# EAGLE design untitled (EAGLE 9.6.2)
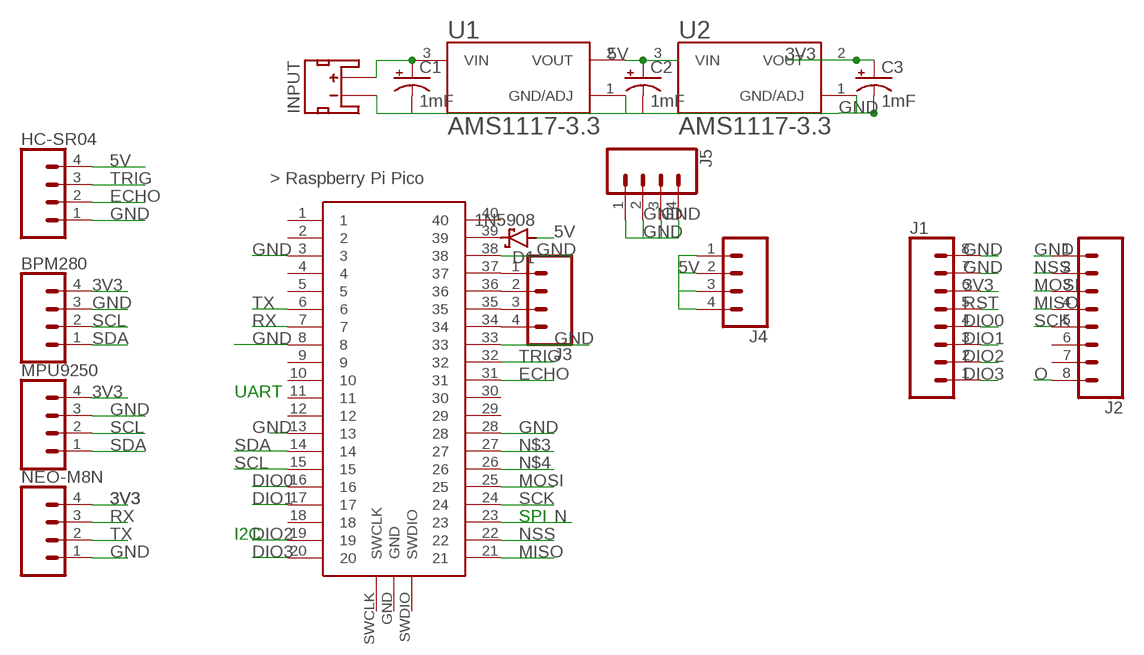
[diagram p0: schematic, sheet 1]

## Parts
BPM280  CONN_04PTH  [1X04]
C1  1mF  1000UF-RADIAL-5MM-25V-20%  [CPOL-RADIAL-5MM-10MM]
C2  1mF  1000UF-RADIAL-5MM-25V-20%  [CPOL-RADIAL-5MM-10MM]
C3  1mF  1000UF-RADIAL-5MM-25V-20%  [CPOL-RADIAL-5MM-10MM]
D1  1N5908  [C4111-15]
HC-SR04  CONN_04PTH  [1X04]
INPUT  JST_2MM_MALE  [JST-2-SMD]
J1  CONN_08NO_SILK_DNP  [1X08_NO_SILK]
J2  CONN_08NO_SILK_DNP  [1X08_NO_SILK]
J3  CONN_041X04_NO_SILK  [1X04_NO_SILK]
J4  CONN_041X04_NO_SILK  [1X04_NO_SILK]
J5  CONN_041X04_NO_SILK  [1X04_NO_SILK]
MPU9250  CONN_04PTH  [1X04]
NEO-M8N  CONN_04PTH  [1X04]
U1  AMS1117-3.3  [SOT229P700X180-4N]
U2  AMS1117-3.3  [SOT229P700X180-4N]
U$1  RASPBERRY-PI-PICO_TH  [FT_RASPBERRY-PI-PICO_TH]

## Nets
3V3: BPM280.4 C3.+ J1.6 MPU9250.4 NEO-M8N.4 U2.2(VOUT)
5V: C2.+ D1.A HC-SR04.4 J4.1 J4.2 J4.3 J4.4 U1.2(VOUT) U2.3(VIN)
DIO0: J1.4 U$1.16
DIO1: J1.3 U$1.17
DIO2: J1.2 U$1.19
DIO3: J1.1 U$1.20
ECHO: HC-SR04.2 U$1.31
GND: BPM280.3 C1.- C2.- C3.- HC-SR04.1 INPUT.1(-) J1.7 J1.8 J2.1 J5.1 J5.2 J5.3 J5.4 MPU9250.3 NEO-M8N.1 U1.1(GND/ADJ) U2.1(GND/ADJ) U$1.3 U$1.8 U$1.13 U$1.28 U$1.33 U$1.38
MISO: J2.4 U$1.21
MOSI: J2.3 U$1.25
N: U$1.23
N$1: C1.+ INPUT.2(+) U1.3(VIN)
N$2: D1.C U$1.39
N$3: U$1.27
N$4: U$1.26
N$5: J3.1 U$1.37
N$6: J3.2 U$1.36
N$7: J3.3 U$1.35
N$8: J3.4 U$1.34
NSS: J2.2 U$1.22
O: J2.8
RST: J1.5
RX: NEO-M8N.3 U$1.7
SCK: J2.5 U$1.24
SCL: BPM280.2 MPU9250.2 U$1.15
SDA: BPM280.1 MPU9250.1 U$1.14
TRIG: HC-SR04.3 U$1.32
TX: NEO-M8N.2 U$1.6
Unconnected: INPUT.NC1(PAD1) INPUT.NC2(PAD2) J2.6 J2.7 U$1.1 U$1.2 U$1.4 U$1.5 U$1.9 U$1.10 U$1.11 U$1.12 U$1.18 U$1.29 U$1.30 U$1.40 U$1.GND U$1.SWCLK U$1.SWDIO

## Notes on the sheet
- UART
- SPI
- I2C

## Library data of the parts
BPM280 HC-SR04 J3-J5 MPU9250 NEO-M8N = SparkFun-Connectors:CONN_04: Multi connection point. Often used as Generic Header-pin footprint for 0.1 inch spaced/style header connections On any of the 0.1 inch spaced packages, you can populate with these: Break Away Headers - Straight <https://www.sparkfun.com/products/116> (PRT-00116) Break Away Male Headers - Right Angle <https://www.sparkfun.com/products/553> (PRT-00553) Female Headers <https://www.sparkfun.com/products/115> (PRT-00115) Break Away Headers - Machine Pin <https://www.sparkfun.com/products/117> (PRT-00117) Break Away Female Headers - Swiss Machine Pin <https://www.sparkfun.com/products/743> (PRT-00743) For SCREWTERMINALS and SPRING TERMINALS visit here: Screw Terimnals on SparkFun.com <https://www.sparkfun.com/search/results?term=Screw+Terminals> (5mm/3.5mm/2.54mm spacing) This device is also useful as a general connection point to wire up your design to another part of your project. Our various solder wires solder well into these plated through hole pads. Hook-Up Wire - Assortment (Stranded, 22 AWG) <https://www.sparkfun.com/products/11375> (PRT-11375) Hook-Up Wire - Assortment (Solid Core, 22 AWG) <https://www.sparkfun.com/products/11367> (PRT-11367) View the entire wire category on our website here <https://www.sparkfun.com/categories/141> Special notes: Molex polarized connector foot print use with SKU : PRT-08231 with associated crimp pins and housings. 1MM SMD Version SKU: PRT-10208; PROD_ID: CONN-09696
C1-C3 = SparkFun-Capacitors:1000UF: 1,000µF/1mF ceramic capacitors A capacitor is a passive two-terminal electrical component used to store electrical energy temporarily in an electric field. CAP-08070; PROD_ID: CAP-09538
D1 = diode:1N5908: DIODE schottky
INPUT = SparkFun-Connectors:JST_2MM_MALE: JST 2MM MALE RA CONNECTOR Two pin, compact surface mount connector. Commonly used as a battery input connection point. We really like the solid locking feeling and high current rating on these small connectors. We use these all the time as battery connectors. Mates to single-cell LiPo batteries. Here is the connector we sell at SparkFun: JST Right Angle Connector - White <https://www.sparkfun.com/products/8612> (PRT-08612) Datasheet <http://www.sparkfun.com/datasheets/Prototyping/Connectors/JST-Horizontal.pdf> It was used on these SparkFun products: SparkFun MOSFET Power Controller <https://www.sparkfun.com/products/11214> (PRT-11214) SparkFun Battery Babysitter - LiPo Battery Manager <https://www.sparkfun.com/products/13777> (PRT-13777) And many, many others that required a lipo battery connection.; PROD_ID: CONN-11443; SF_ID: PRT-08612
J1 J2 = SparkFun-Connectors:CONN_08: Multi connection point. Often used as Generic Header-pin footprint for 0.1 inch spaced/style header connections On any of the 0.1 inch spaced packages, you can populate with these: Break Away Headers - Straight <https://www.sparkfun.com/products/116> (PRT-00116) Break Away Male Headers - Right Angle <https://www.sparkfun.com/products/553> (PRT-00553) Female Headers <https://www.sparkfun.com/products/115> (PRT-00115) Break Away Headers - Machine Pin <https://www.sparkfun.com/products/117> (PRT-00117) Break Away Female Headers - Swiss Machine Pin <https://www.sparkfun.com/products/743> (PRT-00743) Arduino Stackable Header - 8 Pin <https://www.sparkfun.com/products/9279> (PRT-09279) For SCREWTERMINALS and SPRING TERMINALS visit here: Screw Terimnals on SparkFun.com <https://www.sparkfun.com/search/results?term=Screw+Terminals> (5mm/3.5mm/2.54mm spacing) This device is also useful as a general connection point to wire up your design to another part of your project. Our various solder wires solder well into these plated through hole pads. Hook-Up Wire - Assortment (Stranded, 22 AWG) <https://www.sparkfun.com/products/11375> (PRT-11375) Hook-Up Wire - Assortment (Solid Core, 22 AWG) <https://www.sparkfun.com/products/11367> (PRT-11367) View the entire wire category on our website here <https://www.sparkfun.com/categories/141> Special notes: Molex polarized connector foot print use with SKU : PRT-08231 with associated crimp pins and housings. 1MM SMD Version SKU: PRT-10208 NOTES ON THE VARIANTS LOCK and LOCK_LONGPADS... This footprint was designed to help hold the alignment of a through-hole component (i.e. 6-pin header) while soldering it into place. You may notice that each hole has been shifted either up or down by 0.005 of an inch from it's more standard position (which is a perfectly straight line). This slight alteration caused the pins (the squares in the middle) to touch the edges of the holes. Because they are alternating, it causes a "brace" to hold the component in place. 0.005 has proven to be the perfect amount of "off-center" position when using our standard breakaway headers. Although looks a little odd when you look at the bare footprint, once you have a header in there, the alteration is very hard to notice. Also,if you push a header all the way into place, it is covered up entirely on the bottom side.
U1 U2 = AMS1117-3.3:AMS1117-3.3: Check availability <https://pricing.snapeda.com/parts/AMS1117-3.3/Advanced%20Monolithic%20Systems/view-part?ref=eda>; AVAILABILITY: Not in stock; CHECK_PRICES: https://www.snapeda.com/parts/AMS1117-3.3/Advanced+Monolithic+Systems/view-part/?ref=eda; DESCRIPTION: Sot223/Pkg 1-Amp 3.3-Volt Low Drop Out Voltage Regulatator; MF: Advanced Monolithic Systems; MP: AMS1117-3.3; PACKAGE: SOT-223 Seeed Technology; PRICE: None; SNAPEDA_LINK: https://www.snapeda.com/parts/AMS1117-3.3/Advanced+Monolithic+Systems/view-part/?ref=snap
U$1 = pipico:RASPBERRY-PI-PICO_TH: Raspberry Pi Pico microcontroller board for through-hole mounting.

## Board
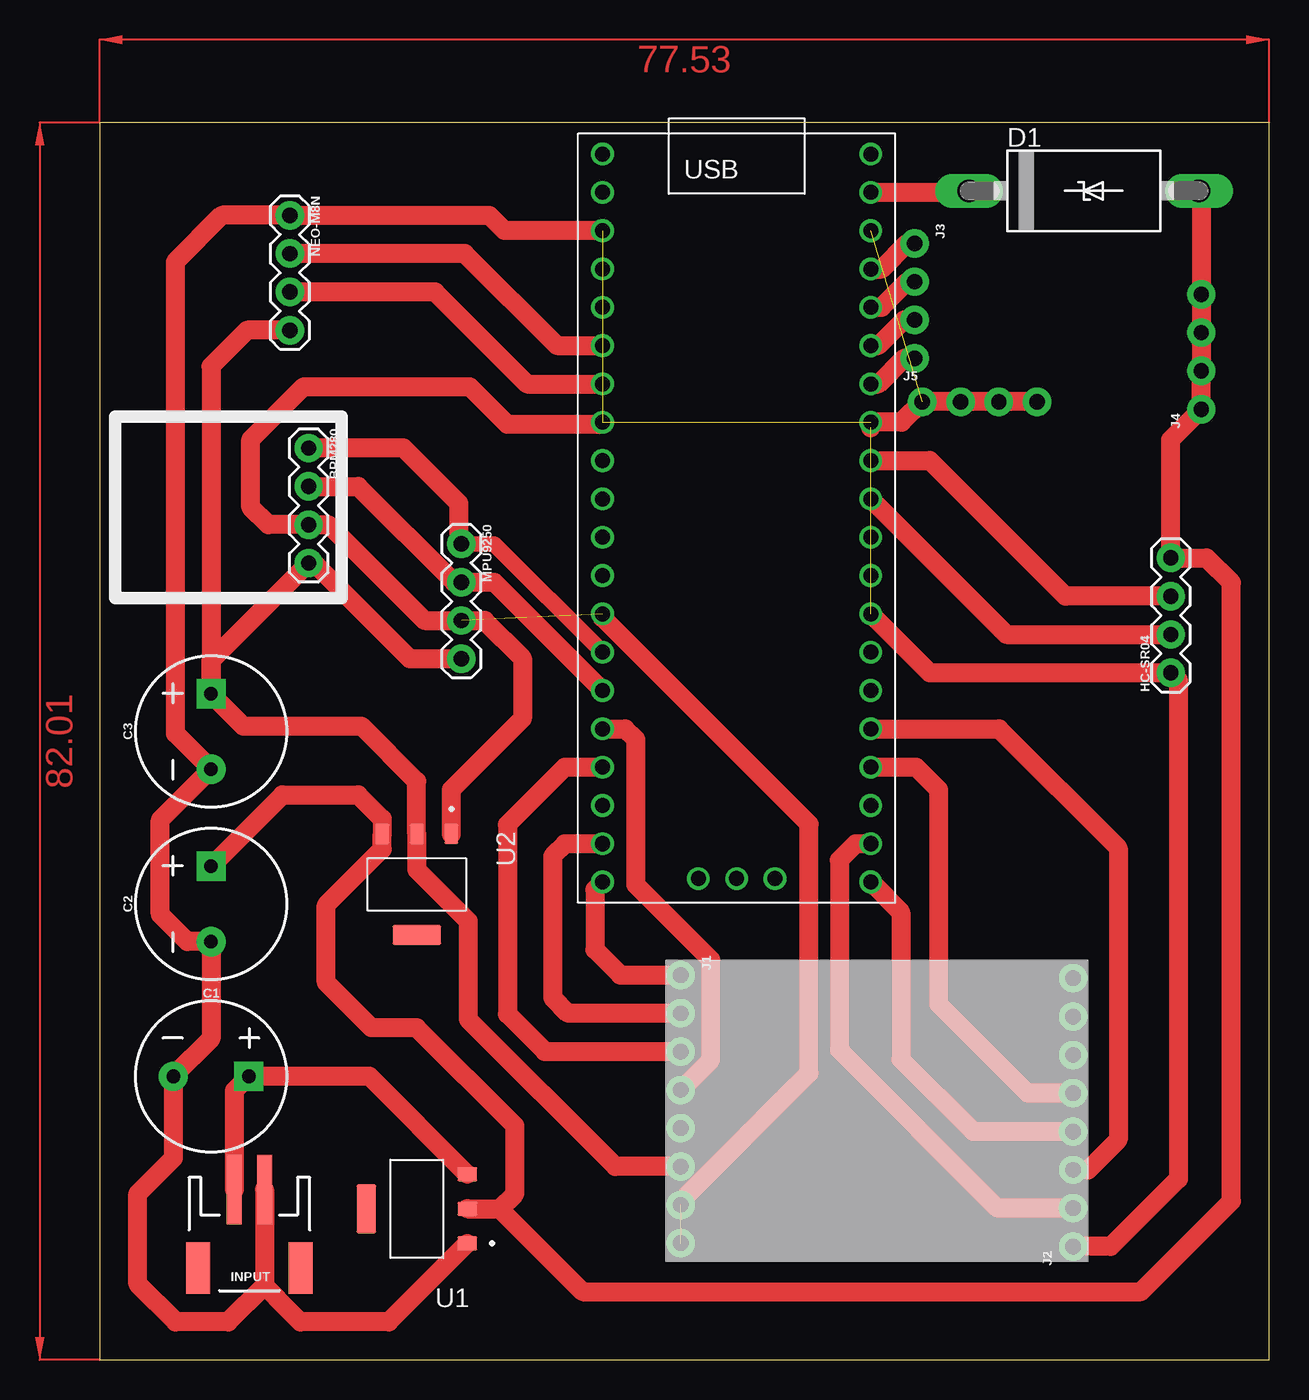
[diagram p1: board, top side]

Size 77.53 x 82.01 mm. Coordinates in mm from the lower left corner, seen from the top.
Outline: 0,0 77.53,0 77.53,82.01 0,82.01 0,0
Copper layers (1*16): Top 0.035mm / dielectric 1.5mm / Bottom 0.035mm
Design rules "default": minimum track width 6mil, minimum drill 0.35mm, track to track 6mil, track to pad 6mil, pad to pad 6mil, via to via 6mil, smd to smd 6mil, copper to edge 40mil, drill to drill 6mil, minimum pad ring 10mil, minimum via ring 8mil, stop-mask expansion 4mil, vias tented up to drill 0mil, thermal gap 10mil

### Footprints (pad centres in the part's own frame; a part is rotated, then mirrored left to right if it is on the bottom)
1X04 = drill 1.016 pad 1.88: 1 0,0; 2 2.54,0; 3 5.08,0; 4 7.62,0
CPOL-RADIAL-5MM-10MM = drill 0.9 pad 1.93 square: + 2.5,0 | drill 0.9 pad 1.93: - -2.5,0
C4111-15 = drill 1.499 long: A 7.62,0; C -7.62,0
JST-2-SMD = smd 1 x 4.6: 1 -1,-3.7; 2 1,-3.7 | smd 1.6 x 3.4: NC1 -3.4,1.5; NC2 3.4,1.5
1X08_NO_SILK = drill 1.016 pad 1.88: 1 0,0; 2 2.54,0; 3 5.08,0; 4 7.62,0; 5 10.16,0; 6 12.7,0; 7 15.24,0; 8 17.78,0
1X04_NO_SILK = drill 1.016 pad 1.88: 1 0,0; 2 2.54,0; 3 5.08,0; 4 7.62,0
SOT229P700X180-4N = smd 1.31 x 0.93: 1 -3.345,2.29; 2 -3.345,0; 3 -3.345,-2.29 | smd 1.31 x 3.24: 4 3.345,0
FT_RASPBERRY-PI-PICO_TH = drill 1: 1 -8.55,24.03; 2 -8.55,21.49; 3 -8.55,18.95; 4 -8.55,16.41; 5 -8.55,13.87; 6 -8.55,11.33; 7 -8.55,8.79; 8 -8.55,6.25; 9 -8.55,3.71; 10 -8.55,1.17; 11 -8.55,-1.37; 12 -8.55,-3.91; 13 -8.55,-6.45; 14 -8.55,-8.99; 15 -8.55,-11.53; 16 -8.55,-14.07; 17 -8.55,-16.61; 18 -8.55,-19.15; 19 -8.55,-21.69; 20 -8.55,-24.23; 21 9.23,-24.23; 22 9.23,-21.69; 23 9.23,-19.15; 24 9.23,-16.61; 25 9.23,-14.07; 26 9.23,-11.53; 27 9.23,-8.99; 28 9.23,-6.45; 29 9.23,-3.91; 30 9.23,-1.37; 31 9.23,1.17; 32 9.23,3.71; 33 9.23,6.25; 34 9.23,8.79; 35 9.23,11.33; 36 9.23,13.87; 37 9.23,16.41; 38 9.23,18.95; 39 9.23,21.49; 40 9.23,24.03; GND 0.34,-24; SWCLK -2.2,-24; SWDIO 2.88,-24

### Placement (x,y rotation side)
BPM280  13.86,60.44 270 top
C1  7.39,18.79 0 top
C2  7.39,30.22 90 top
C3  7.39,41.65 90 top
D1  65.25,77.49 0 top
HC-SR04  71.01,45.54 90 top
INPUT  9.93,7.59 180 top
J1  38.53,25.51 270 top
J2  64.53,7.51 90 top
J3  54.03,74.01 270 top
J4  73.03,63.01 90 top
J5  54.53,63.51 0 top
MPU9250  23.99,54.09 270 top
NEO-M8N  12.61,75.87 270 top
U1  21.03,10.01 180 top
U2  21.03,31.51 270 top
U$1  41.89,55.9 0 top

### Tracks (layer width: path | path; a pad name or v marks a point on that pad's centre or on a via)
3V3
  Top 1.016: J1.6 37.7,12.81 | MPU9250.4 23.84,46.47
  Top 1.27: C3.+ 9.53,42.01 17.36,42.01 21.03,38.34 U2.2 21.03,32.5 24.44,29.09 24.44,22.57 34.2,12.81 J1.6 | C3.+ 7.39,46.35 BPM280.4 14.22,52.82 20.57,46.47 MPU9250.4 | NEO-M8N.4 9.77,68.25 7.39,65.87 C3.+
5V
  Top 1.27: D1.A 73.03,77.33 J4.4 J4.3 J4.2 J4.1 71.01,60.99 HC-SR04.4 73.38,53.16 75.03,51.51 75.03,10.51 69.03,4.51 32.03,4.51 26.53,10.01 | C2.+ 12.12,37.45 17.15,37.45 18.74,35.85 U2.3 18.74,33.85 15.03,30.14 15.03,25.01 18.03,22.01 21.03,22.01 27.53,15.51 27.53,11.01 26.53,10.01 | U1.2 26.53,10.01
DIO0
  Top 1.27: U$1.16 34.84,41.83 35.53,41.14 35.53,31.51 40.53,26.51 40.53,19.89 J1.4
DIO1
  Top 1.27: U$1.17 30.84,39.29 27.03,35.48 27.03,22.93 29.53,20.43 J1.3
DIO2
  Top 1.27: U$1.19 30.84,34.21 30.03,33.4 30.03,24.01 31.07,22.97 J1.2
DIO3
  Top 1.27: U$1.20 32.84,31.17 32.84,27.2 34.53,25.51 J1.1
ECHO
  Top 1.27: U$1.31 60.11,48.08 HC-SR04.2
GND  (6 unrouted)
  Top 1.016: 23.66,38.14 28.03,42.51
  Top 1.27: J5.4 J5.3 J5.2 J5.1 53.17,62.15 U$1.33 51.12,61.79 | U$1.3 26.84,74.85 25.84,75.85 12.63,75.85 NEO-M8N.1 8.11,75.87 5.03,72.79 5.03,41.51 C3.- 4.03,35.79 4.03,29.51 5.82,27.72 C2.- 7.39,21.29 C1.- 4.89,13.37 2.53,11.01 2.53,5.01 5.03,2.51 8.53,2.51 10.93,4.91 | INPUT.1 10.93,4.91 | U$1.28 55.03,45.54 HC-SR04.1 71.51,45.04 71.51,11.99 67.03,7.51 J2.1 | J1.7 38.53,10.51 47.03,19.01 47.03,35.51 33.34,49.2 U$1.13 | U1.1 19.16,2.51 13.3,2.51 11.74,4.06 11.74,4.1 10.93,4.91 | U$1.8 33.2,62.01 27.03,62.01 24.53,64.51 13.53,64.51 10.03,61.01 10.03,56.51 11.18,55.36 BPM280.3 15.18,55.36 21.53,49.01 MPU9250.3 25.53,49.01 28.03,46.51 28.03,42.51 23.32,37.8 U2.1
MISO
  Top 1.27: U$1.21 53.12,29.67 53.12,19.92 57.91,15.13 J2.4
MOSI
  Top 1.27: U$1.25 59.62,41.83 67.53,33.92 67.53,14.59 65.53,12.59 J2.3
N$1
  Top 1.27: INPUT.2 8.93,17.83 C1.+ 17.88,18.79 U1.3
N$2
  Top 1.27: U$1.39 57.53,77.39 D1.C
N$5
  Top 1.27: U$1.37 51.83,72.31 53.53,74.01 J3.1
N$6
  Top 1.27: U$1.36 51.83,69.77 53.53,71.47 J3.2
N$7
  Top 1.27: U$1.35 51.62,67.23 53.32,68.93 J3.3
N$8
  Top 1.27: J3.4 53.32,66.39 51.62,64.69 U$1.34
NSS
  Top 1.27: U$1.22 50.12,34.21 49.03,33.12 49.03,20.55 59.53,10.05 J2.2
RX
  Top 1.27: U$1.7 28.35,64.69 22.25,70.79 NEO-M8N.3
SCK
  Top 1.016: 55.86,23.34 55.61,23.59
  Top 1.27: U$1.24 54.12,39.29 55.61,37.8 55.61,23.59 | J2.5 61.53,17.67 55.86,23.34
SCL
  Top 1.27: BPM280.2 17.14,57.9 23.49,51.55 MPU9250.2 26.16,51.55 U$1.15
SDA
  Top 1.016: 23.8,54.28 MPU9250.1 26.16,54.09 U$1.14
  Top 1.27: BPM280.1 20.14,60.44 23.8,56.78 23.8,54.28
TRIG
  Top 1.27: U$1.32 55.04,59.61 64.03,50.62 HC-SR04.3
TX
  Top 1.27: NEO-M8N.2 24.21,73.33 30.31,67.23 U$1.6
(copper drawn outside any net)
  shapes: Top area x2